# Altium schematic sheet keymap.SchDoc
size A3; Organization: Develer s.r.l.; Address1: via Mugellese 1/A; Address2: 50019 Campi Bisenzio; Address3: Firenze; Address4: ITALY; Revision: A; SheetNumber: 1; SheetTotal: 1
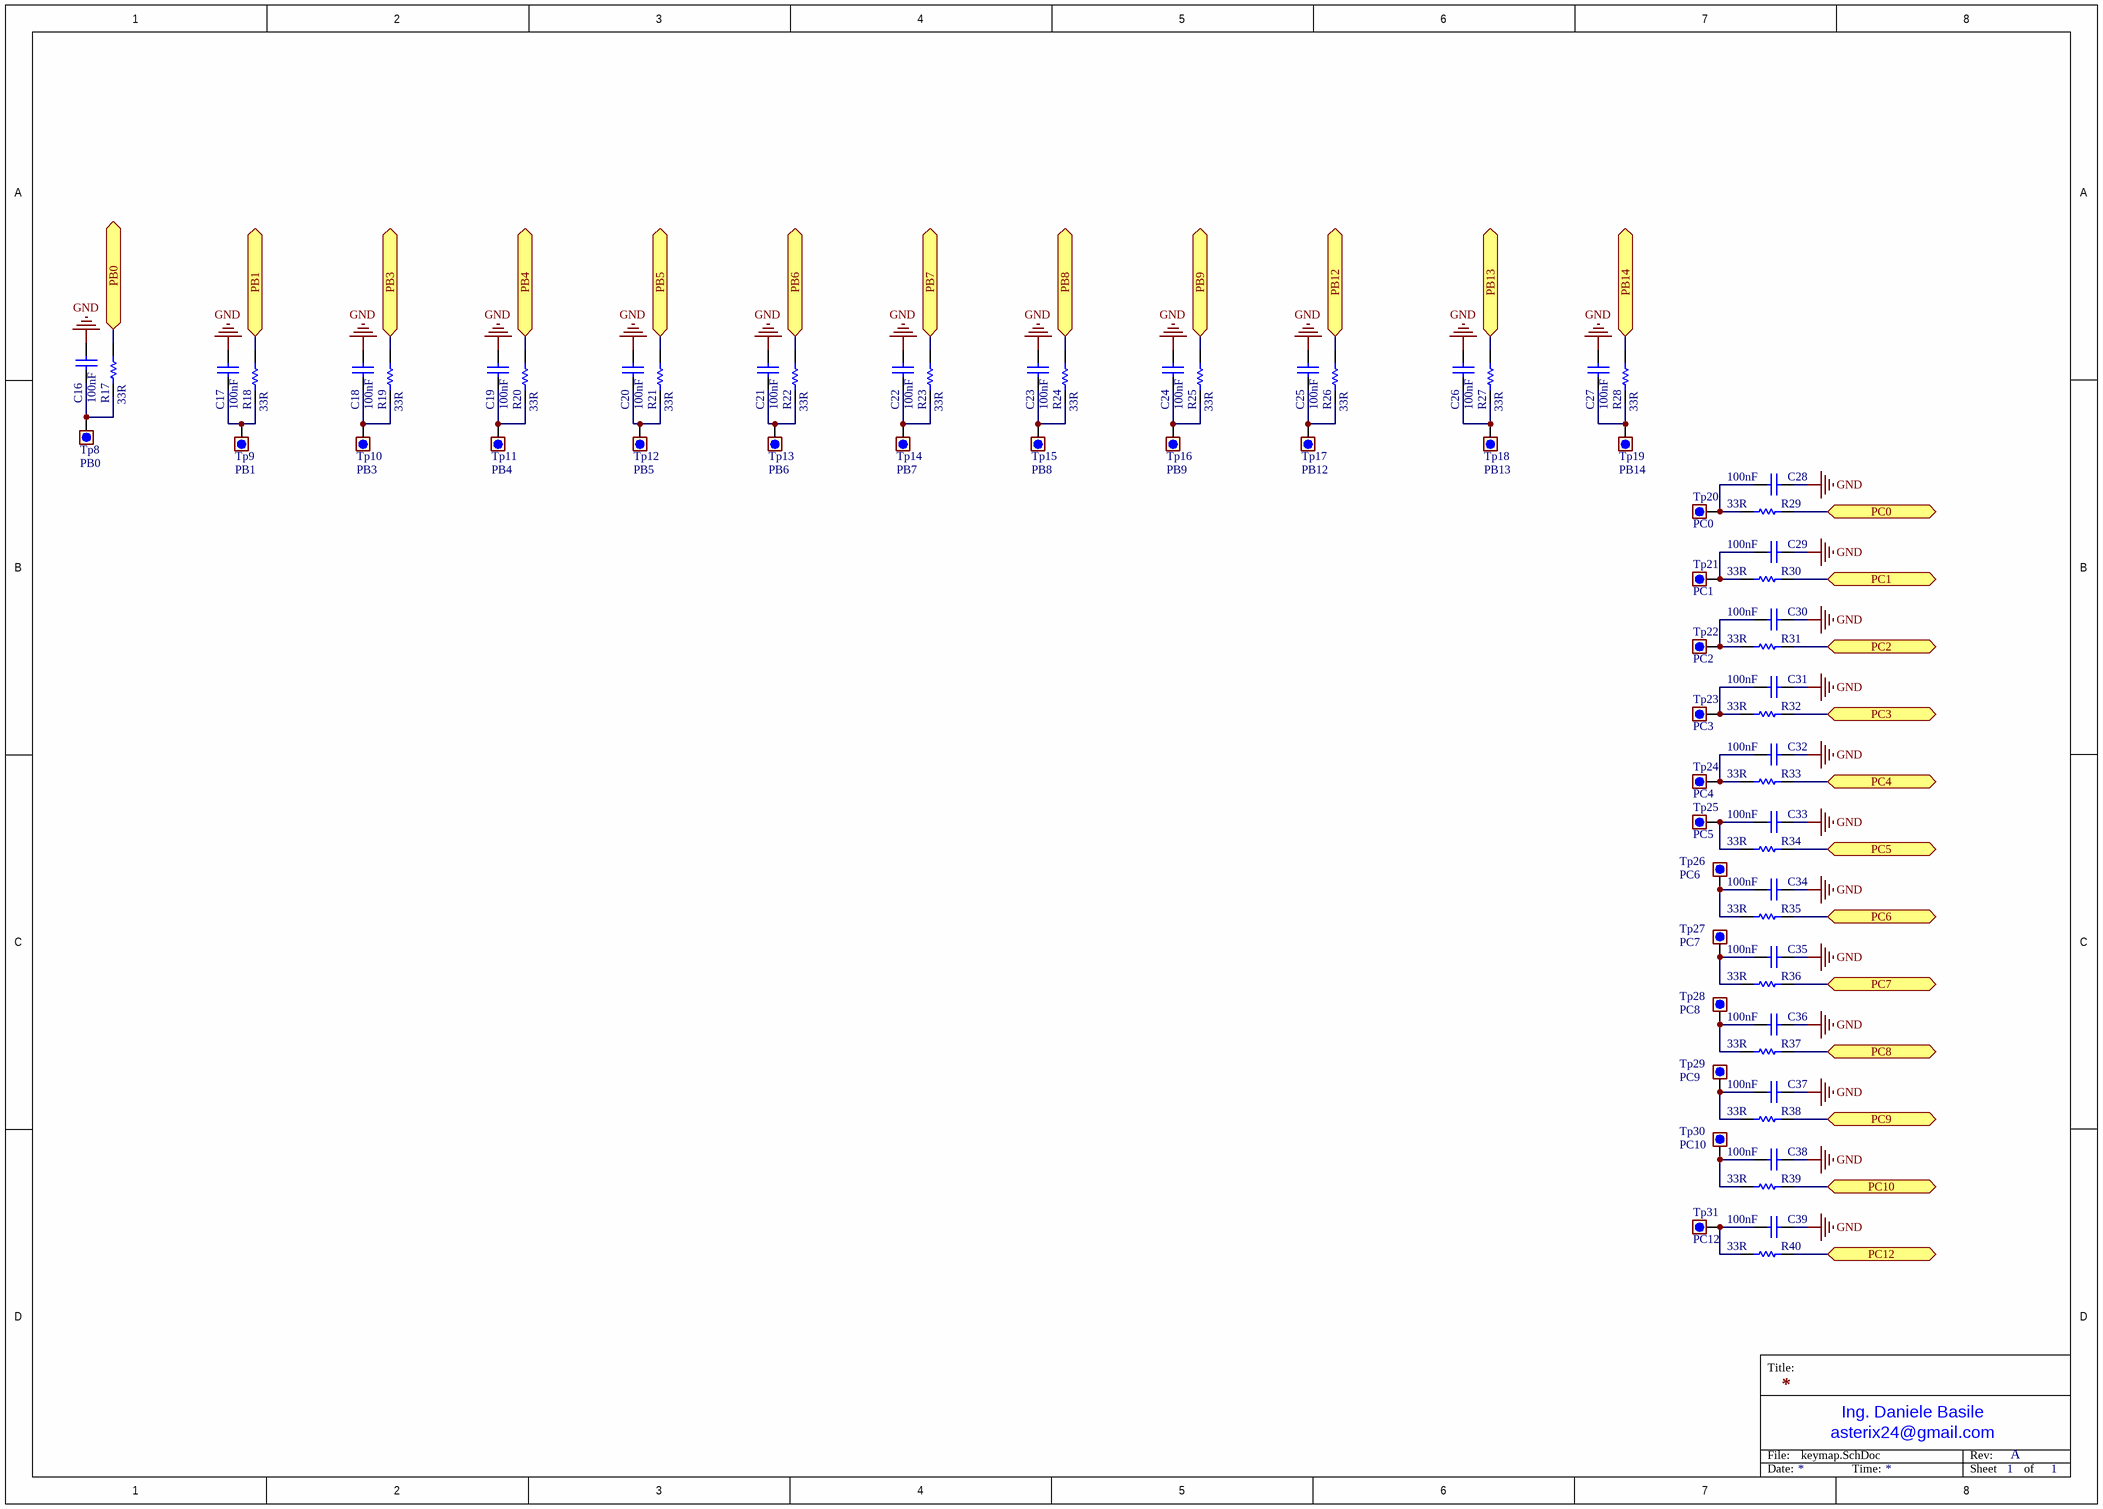
[diagram p0: keymap.SchDoc]

## Parts
C16  100nF  [0603_[1608]]
C17  100nF  [0603_[1608]]
C18  100nF  [0603_[1608]]
C19  100nF  [0603_[1608]]
C20  100nF  [0603_[1608]]
C21  100nF  [0603_[1608]]
C22  100nF  [0603_[1608]]
C23  100nF  [0603_[1608]]
C24  100nF  [0603_[1608]]
C25  100nF  [0603_[1608]]
C26  100nF  [0603_[1608]]
C27  100nF  [0603_[1608]]
C28  100nF  [0603_[1608]]
C29  100nF  [0603_[1608]]
C30  100nF  [0603_[1608]]
C31  100nF  [0603_[1608]]
C32  100nF  [0603_[1608]]
C33  100nF  [0603_[1608]]
C34  100nF  [0603_[1608]]
C35  100nF  [0603_[1608]]
C36  100nF  [0603_[1608]]
C37  100nF  [0603_[1608]]
C38  100nF  [0603_[1608]]
C39  100nF  [0603_[1608]]
R17  33R  [0603_[1608]]
R18  33R  [0603_[1608]]
R19  33R  [0603_[1608]]
R20  33R  [0603_[1608]]
R21  33R  [0603_[1608]]
R22  33R  [0603_[1608]]
R23  33R  [0603_[1608]]
R24  33R  [0603_[1608]]
R25  33R  [0603_[1608]]
R26  33R  [0603_[1608]]
R27  33R  [0603_[1608]]
R28  33R  [0603_[1608]]
R29  33R  [0603_[1608]]
R30  33R  [0603_[1608]]
R31  33R  [0603_[1608]]
R32  33R  [0603_[1608]]
R33  33R  [0603_[1608]]
R34  33R  [0603_[1608]]
R35  33R  [0603_[1608]]
R36  33R  [0603_[1608]]
R37  33R  [0603_[1608]]
R38  33R  [0603_[1608]]
R39  33R  [0603_[1608]]
R40  33R  [0603_[1608]]
Tp8  PB0  [TEST_POINT_THD_D1.6mm_oval]  (no BOM)
Tp9  PB1  [TEST_POINT_THD_D1.6mm_oval]  (no BOM)
Tp10  PB3  [TEST_POINT_THD_D1.6mm_oval]  (no BOM)
Tp11  PB4  [TEST_POINT_THD_D1.6mm_oval]  (no BOM)
Tp12  PB5  [TEST_POINT_THD_D1.6mm_oval]  (no BOM)
Tp13  PB6  [TEST_POINT_THD_D1.6mm_oval]  (no BOM)
Tp14  PB7  [TEST_POINT_THD_D1.6mm_oval]  (no BOM)
Tp15  PB8  [TEST_POINT_THD_D1.6mm_oval]  (no BOM)
Tp16  PB9  [TEST_POINT_THD_D1.6mm_oval]  (no BOM)
Tp17  PB12  [TEST_POINT_THD_D1.6mm_oval]  (no BOM)
Tp18  PB13  [TEST_POINT_THD_D1.6mm_oval]  (no BOM)
Tp19  PB14  [TEST_POINT_THD_D1.6mm_oval]  (no BOM)
Tp20  PC0  [TEST_POINT_THD_D1.6mm_oval]  (no BOM)
Tp21  PC1  [TEST_POINT_THD_D1.6mm_oval]  (no BOM)
Tp22  PC2  [TEST_POINT_THD_D1.6mm_oval]  (no BOM)
Tp23  PC3  [TEST_POINT_THD_D1.6mm_oval]  (no BOM)
Tp24  PC4  [TEST_POINT_THD_D1.6mm_oval]  (no BOM)
Tp25  PC5  [TEST_POINT_THD_D1.6mm_oval]  (no BOM)
Tp26  PC6  [TEST_POINT_THD_D1.6mm_oval]  (no BOM)
Tp27  PC7  [TEST_POINT_THD_D1.6mm_oval]  (no BOM)
Tp28  PC8  [TEST_POINT_THD_D1.6mm_oval]  (no BOM)
Tp29  PC9  [TEST_POINT_THD_D1.6mm_oval]  (no BOM)
Tp30  PC10  [TEST_POINT_THD_D1.6mm_oval]  (no BOM)
Tp31  PC12  [TEST_POINT_THD_D1.6mm_oval]  (no BOM)

## Ports
PB0, PB1, PB3, PB4, PB5, PB6, PB7, PB8, PB9, PB12, PB13, PB14, PC0, PC1, PC2, PC3, PC4, PC5, PC6, PC7, PC8, PC9, PC10, PC12

## Nets
GND: C16.2 C17.2 C18.2 C19.2 C20.2 C21.2 C22.2 C23.2 C24.2 C25.2 C26.2 C27.2 C28.2 C29.2 C30.2 C31.2 C32.2 C33.2 C34.2 C35.2 C36.2 C37.2 C38.2 C39.2
PB0: R17.2 ; port PB0
PB1: R18.2 ; port PB1
PB3: R19.2 ; port PB3
PB4: R20.2 ; port PB4
PB5: R21.2 ; port PB5
PB6: R22.2 ; port PB6
PB7: R23.2 ; port PB7
PB8: R24.2 ; port PB8
PB9: R25.2 ; port PB9
PB12: R26.2 ; port PB12
PB13: R27.2 ; port PB13
PB14: R28.2 ; port PB14
PC0: R29.2 ; port PC0
PC1: R30.2 ; port PC1
PC2: R31.2 ; port PC2
PC3: R32.2 ; port PC3
PC4: R33.2 ; port PC4
PC5: R34.2 ; port PC5
PC6: R35.2 ; port PC6
PC7: R36.2 ; port PC7
PC8: R37.2 ; port PC8
PC9: R38.2 ; port PC9
PC10: R39.2 ; port PC10
PC12: R40.2 ; port PC12
NetC16_1: C16.1 R17.1 Tp8.1
NetC17_1: C17.1 R18.1 Tp9.1
NetC18_1: C18.1 R19.1 Tp10.1
NetC19_1: C19.1 R20.1 Tp11.1
NetC20_1: C20.1 R21.1 Tp12.1
NetC21_1: C21.1 R22.1 Tp13.1
NetC22_1: C22.1 R23.1 Tp14.1
NetC23_1: C23.1 R24.1 Tp15.1
NetC24_1: C24.1 R25.1 Tp16.1
NetC25_1: C25.1 R26.1 Tp17.1
NetC26_1: C26.1 R27.1 Tp18.1
NetC27_1: C27.1 R28.1 Tp19.1
NetC28_1: C28.1 R29.1 Tp20.1
NetC29_1: C29.1 R30.1 Tp21.1
NetC30_1: C30.1 R31.1 Tp22.1
NetC31_1: C31.1 R32.1 Tp23.1
NetC32_1: C32.1 R33.1 Tp24.1
NetC33_1: C33.1 R34.1 Tp25.1
NetC34_1: C34.1 R35.1 Tp26.1
NetC35_1: C35.1 R36.1 Tp27.1
NetC36_1: C36.1 R37.1 Tp28.1
NetC37_1: C37.1 R38.1 Tp29.1
NetC38_1: C38.1 R39.1 Tp30.1
NetC39_1: C39.1 R40.1 Tp31.1

## Notes on the sheet
- Title:
- File:
- asterix24@gmail.com
- Ing. Daniele Basile
- Rev:
- Date:
- Time:
- Sheet
- of

## Library data of the parts
C16-C39 = Cap: Ceramic X7R 50V; Value: 10nF; Published: 8-Jun-2000; Revision: July-2002: Re-released for DXP Platform.; Publisher: Altium Limited
R17-R40 = Res1: Resistor; Value: 1K; Published: 8-Jun-2000; Revision: July-2002: Re-released for DXP Platform.; Publisher: Altium Limited
Tp8-Tp31 = Test_point: Test point